# Altium schematic sheet MCU.SchDoc
size 292 x 193 mm; Author: Power Lin; DocumentNumber: 2; SheetNumber: 2; SheetTotal: 4; Website: wiki-power.com
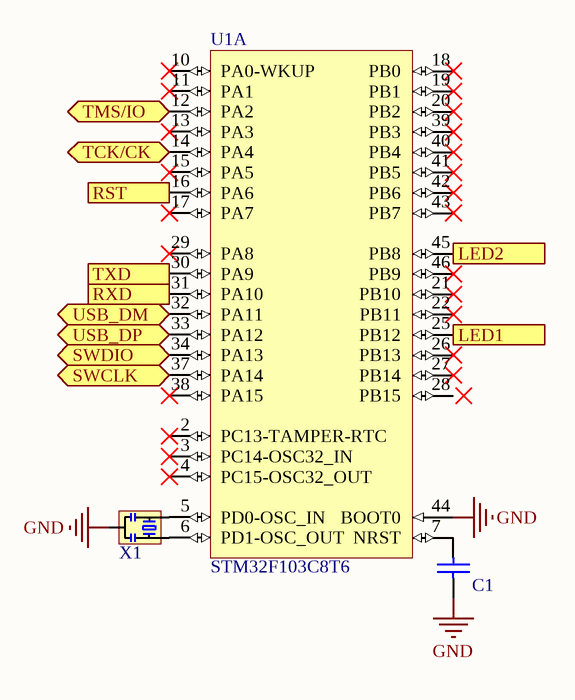
[diagram p0: MCU.SchDoc]

## Parts
C1  100nF  [CAP-0603]  (value not drawn)
U1  STM32F103C8T6  [LQFP_48]  (part A of 2)
X1  8MHz  [CSTCE_G(A)村田晶振]  (value not drawn)

## Ports
LED1 (out), LED2 (out), RST (out), RXD (in), SWCLK (bidir), SWDIO (bidir), TCK/CK (bidir), TMS/IO (bidir), TXD (out), USB_DM (bidir), USB_DP (bidir)

## Nets
GND: C1.2 U1.44(BOOT0) X1.2(GND)
LED1: U1.25(PB12) ; port LED1
LED2: U1.45(PB8) ; port LED2
RST: U1.16(PA6) ; port RST
RXD: U1.31(PA10) ; port RXD
SWCLK: U1.37(PA14) ; port SWCLK
SWDIO: U1.34(PA13) ; port SWDIO
TCK/CK: U1.14(PA4) ; port TCK/CK
TMS/IO: U1.12(PA2) ; port TMS/IO
TXD: U1.30(PA9) ; port TXD
USB_DM: U1.32(PA11) ; port USB_DM
USB_DP: U1.33(PA12) ; port USB_DP
NetC1_1: C1.1 U1.7(NRST)
NetU1_5: U1.5(PD0-OSC_IN) X1.1(OSC1)
NetU1_6: U1.6(PD1-OSC_OUT) X1.3(OSC2)

Not connected (* = marked no-connect by the designer): U1 2(PC13-TAMPER-RTC)* 3(PC14-OSC32_IN)* 4(PC15-OSC32_OUT)* 10(PA0-WKUP)* 11(PA1)* 13(PA3)* 15(PA5)* 17(PA7)* 18(PB0)* 19(PB1)* 20(PB2)* 21(PB10)* 22(PB11)* 26(PB13)* 27(PB14)* 28(PB15) 29(PA8)* 38(PA15)* 39(PB3)* 40(PB4)* 41(PB5)* 42(PB6)* 43(PB7)* 46(PB9)*

## Notes on the sheet
- Author
- DocumentName
- ModifiedDate
- ProjectName
- SheetNumber
- SheetTotal
- Website
- Revision

## Library data of the parts
C1 = CAP: 贴片电容; ComponentLink1Description: 供应商链接; ComponentLink1URL: http://www.szlcsc.com/product/details_53938.html; Package: 0402; Supplier: LC; SuppliersPartNumber: C52923
U1 = STM32F103Cx: 单片机; PartNumber: STM32F100C8T6B; A/D Converter: 1x12-bit (10 Channel); Core: ARM Cortex-M3; D/A Converter: 2x12-bit (2 Channel); FLASH Size (Prog) (kB): 64; I/Os (High Current): 37; Internal RAM Size (kB): 8; Operating Frequency(F) (Processor speed) (MHz): 24; Packing: Tray; Supply Voltage(Vcc) min (V): 2; DatasheetVersion: Rev. 7; PackageVersion: Rev. 6, 06/2013; PackageReference: LQFP48; PackageDescription: 48-Pin Low Profile Quad Flat Package, 7 x 7 mm Body, 0.5 mm Pitch; Supplier 1: Digi-Key; Supplier Part Number 1: 497-10499-ND; Supplier 2: Farnell; Supplier Part Number 2: 1838511; Supplier 3: Newark; Supplier Part Number 3: 76R0988; Supplier 4: Mouser; Supplier Part Number 4: 511-STM32F100C8T6B; Mounting Technology: Surface Mount; ComponentLink1Description: Manufacturer URL; ComponentLink1URL: http://www.st.com/web/en/home.html; ComponentLink2Description: Datasheet; ComponentLink2URL: http://www.st.com/st-web-ui/static/active/en/resource/technical/document/datasheet/CD00251732.pdf; ComponentLink3Description: Package Specification; ComponentLink3URL: http://www.st.com/st-web-ui/static/active/en/resource/technical/document/datasheet/DM00058181.pdf
X1 = XTAL: 有源晶振